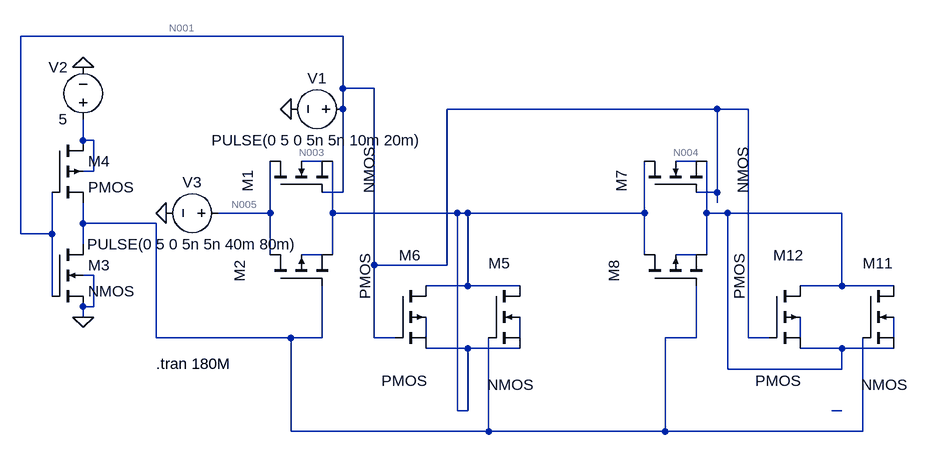
[diagram p0: schematic D-FlipFlop.asc]
D-FlipFlop.asc, the LTspice schematic file:
Version 4
SHEET 1 1200 680
WIRE 208 -144 -288 -144
WIRE 208 -64 208 -144
WIRE 256 -64 208 -64
WIRE 208 -32 208 -64
WIRE 784 -32 368 -32
WIRE 832 -32 784 -32
WIRE -192 16 -192 -16
WIRE -176 16 -192 16
WIRE 176 48 144 48
WIRE 752 48 720 48
WIRE -176 64 -176 16
WIRE -176 64 -192 64
WIRE 208 96 208 -32
WIRE 208 96 176 96
WIRE 784 96 784 -32
WIRE 784 96 752 96
WIRE 784 112 784 96
WIRE 96 128 96 48
WIRE 96 128 16 128
WIRE 192 128 192 48
WIRE 384 128 192 128
WIRE 400 128 384 128
WIRE 672 128 672 48
WIRE 672 128 400 128
WIRE 768 128 768 48
WIRE 800 128 768 128
WIRE 976 128 800 128
WIRE -192 144 -192 112
WIRE -80 144 -192 144
WIRE -288 160 -288 -144
WIRE -240 160 -240 96
WIRE -240 160 -288 160
WIRE -192 176 -192 144
WIRE 96 192 96 128
WIRE 176 192 144 192
WIRE 192 192 192 128
WIRE 672 192 672 128
WIRE 752 192 720 192
WIRE 768 192 768 128
WIRE 256 208 256 -64
WIRE 368 208 368 -32
WIRE 368 208 256 208
WIRE -176 224 -192 224
WIRE 400 240 400 128
WIRE 400 240 336 240
WIRE 480 240 400 240
WIRE 976 240 976 128
WIRE 976 240 912 240
WIRE 1056 240 976 240
WIRE -240 256 -240 160
WIRE -176 272 -176 224
WIRE -176 272 -192 272
WIRE -192 288 -192 272
WIRE -80 320 -80 144
WIRE 128 320 -80 320
WIRE 176 320 176 240
WIRE 176 320 128 320
WIRE 256 320 256 208
WIRE 288 320 256 320
WIRE 336 320 336 288
WIRE 480 320 480 288
WIRE 752 320 752 240
WIRE 752 320 704 320
WIRE 832 320 832 -32
WIRE 864 320 832 320
WIRE 912 320 912 288
WIRE 1056 320 1056 288
WIRE 400 336 336 336
WIRE 480 336 400 336
WIRE 976 336 912 336
WIRE 1056 336 976 336
WIRE 800 368 800 128
WIRE 976 368 976 336
WIRE 976 368 800 368
WIRE 384 432 384 128
WIRE 400 432 400 336
WIRE 400 432 384 432
WIRE 976 432 960 432
WIRE 128 464 128 320
WIRE 432 464 432 320
WIRE 432 464 128 464
WIRE 704 464 704 320
WIRE 704 464 432 464
WIRE 1008 464 1008 320
WIRE 1008 464 704 464
FLAG 128 -32 0
FLAG -64 128 0
FLAG -192 288 0
FLAG -192 -96 0
SYMBOL nmos4 96 96 R270
WINDOW 0 0 -35 Left 2
WINDOW 3 -2 152 Left 2
SYMATTR InstName M1
SYMBOL pmos4 96 240 R270
WINDOW 0 6 -47 Left 2
WINDOW 3 -21 146 Left 2
SYMATTR InstName M2
SYMBOL voltage 224 -32 R90
WINDOW 0 -32 56 VBottom 2
WINDOW 3 32 56 VTop 2
WINDOW 123 0 0 Left 0
WINDOW 39 0 0 Left 0
SYMATTR InstName V1
SYMATTR Value PULSE(0 5 0 5n 5n 10m 20m)
SYMBOL voltage 32 128 R90
WINDOW 0 -32 56 VBottom 2
WINDOW 3 32 56 VTop 2
WINDOW 123 0 0 Left 0
WINDOW 39 0 0 Left 0
SYMATTR InstName V3
SYMATTR Value PULSE(0 5 0 5n 5n 40m 80m)
SYMBOL nmos4 -240 176 R0
SYMATTR InstName M3
SYMBOL pmos4 -240 16 R0
SYMATTR InstName M4
SYMBOL voltage -192 0 R180
WINDOW 0 24 96 Left 2
WINDOW 3 24 16 Left 2
WINDOW 123 0 0 Left 0
WINDOW 39 0 0 Left 0
SYMATTR InstName V2
SYMATTR Value 5
SYMBOL nmos4 432 240 R0
WINDOW 0 0 -35 Left 2
WINDOW 3 -2 152 Left 2
SYMATTR InstName M5
SYMBOL pmos4 288 240 R0
WINDOW 0 6 -47 Left 2
WINDOW 3 -21 146 Left 2
SYMATTR InstName M6
SYMBOL nmos4 672 96 R270
WINDOW 0 0 -35 Left 2
WINDOW 3 -2 152 Left 2
SYMATTR InstName M7
SYMBOL pmos4 672 240 R270
WINDOW 0 6 -47 Left 2
WINDOW 3 -21 146 Left 2
SYMATTR InstName M8
SYMBOL nmos4 1008 240 R0
WINDOW 0 0 -35 Left 2
WINDOW 3 -2 152 Left 2
SYMATTR InstName M11
SYMBOL pmos4 864 240 R0
WINDOW 0 6 -47 Left 2
WINDOW 3 -21 146 Left 2
SYMATTR InstName M12
TEXT -80 360 Left 2 !.tran 180M

The netlist it stands for:
* D-FlipFlop.asc
M1 N005 N001 N006 N003 NMOS
M2 N005 N008 N006 N009 PMOS
V1 N001 0 PULSE(0 5 0 5n 5n 10m 20m)
V3 N005 0 PULSE(0 5 0 5n 5n 40m 80m)
M3 N008 N001 0 0 NMOS
M4 N002 N001 N008 N002 PMOS
V2 N002 0 5
M5 N006 N008 N006 N012 NMOS
M6 N006 N001 N006 N011 PMOS
M7 N006 N001 N007 N004 NMOS
M8 N006 N008 N007 N010 PMOS
M11 N007 N008 N007 N014 NMOS
M12 N007 N001 N007 N013 PMOS
.model NMOS NMOS
.model PMOS PMOS
.lib standard.mos
.tran 180M
.backanno
.end

* Results of the author's LTspice run, read from the files saved beside the schematic
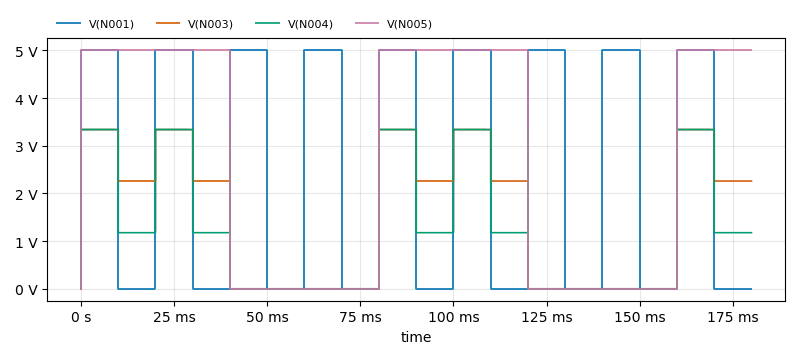
[diagram p1: Transient Analysis of D-FlipFlop.asc, plotted from the saved traces]
* Transient Analysis, 1 run:
*   V(N001): min 0 V, max 5 V, average 2.5 V, rms 3.536 V, last 0 V
*   V(N003): min 0 V, max 3.34 V, average 1.556 V, rms 2.125 V, last 2.26 V
*   V(N004): min 0 V, max 3.341 V, average 1.254 V, rms 1.866 V, last 1.176 V
*   V(N005): min 0 V, max 5 V, average 2.778 V, rms 3.727 V, last 5 V